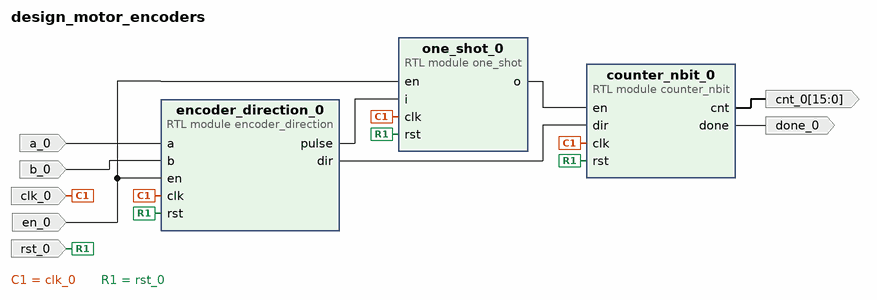
[diagram p0: block diagram of the top level]
# Vivado block design design_motor_encoders, xc7z020clg400-1, Vivado 2024.2
create_bd_design design_motor_encoders

create_bd_port -dir I a_0
create_bd_port -dir I b_0
create_bd_port -dir O -from 15 -to 0 cnt_0
create_bd_port -dir O done_0
create_bd_port -dir I en_0
create_bd_port -dir I -type clk clk_0
create_bd_port -dir I -type rst rst_0

create_bd_cell -type module -reference encoder_direction encoder_direction_0
create_bd_cell -type module -reference counter_nbit counter_nbit_0
set_property -dict {CONFIG.max_cnt 360 CONFIG.n_bits 16} [get_bd_cells counter_nbit_0]
create_bd_cell -type module -reference one_shot one_shot_0

# ---- connections ----

connect_bd_net -net a_0_1 [get_bd_ports a_0] [get_bd_pins encoder_direction_0/a]
connect_bd_net -net b_0_1 [get_bd_ports b_0] [get_bd_pins encoder_direction_0/b]
connect_bd_net -net clk_0_1 [get_bd_ports clk_0] [get_bd_pins counter_nbit_0/clk] [get_bd_pins encoder_direction_0/clk] [get_bd_pins one_shot_0/clk]
connect_bd_net [get_bd_pins counter_nbit_0/cnt] [get_bd_ports cnt_0]
connect_bd_net [get_bd_pins counter_nbit_0/done] [get_bd_ports done_0]
connect_bd_net -net en_0_1 [get_bd_ports en_0] [get_bd_pins encoder_direction_0/en] [get_bd_pins one_shot_0/en]
connect_bd_net [get_bd_pins encoder_direction_0/dir] [get_bd_pins counter_nbit_0/dir]
connect_bd_net [get_bd_pins encoder_direction_0/pulse] [get_bd_pins one_shot_0/i]
connect_bd_net [get_bd_pins one_shot_0/o] [get_bd_pins counter_nbit_0/en]
connect_bd_net -net rst_0_1 [get_bd_ports rst_0] [get_bd_pins counter_nbit_0/rst] [get_bd_pins encoder_direction_0/rst] [get_bd_pins one_shot_0/rst]

validate_bd_design
save_bd_design
